# EAGLE design quadripod_2lm_nano (EAGLE 9.0.1)
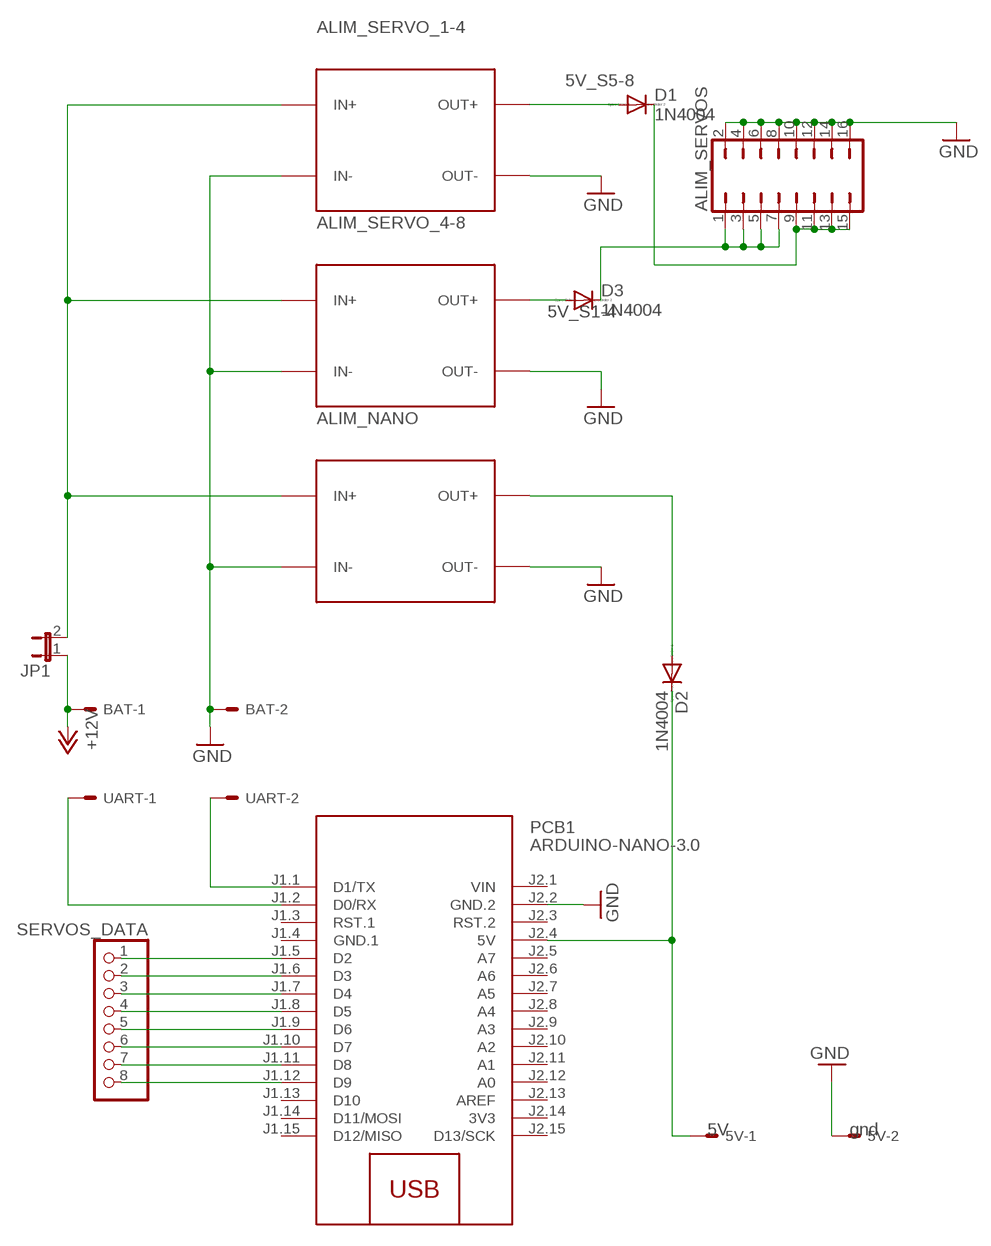
[diagram p0: schematic, sheet 1]

## Parts
5V  332-02  [332-02]
ALIM_NANO  DC-DC-STEP-DOWN-LM2596  [DC-DC-STEP-DOWN-LM2596]
ALIM_SERVO_1-4  DC-DC-STEP-DOWN-LM2596  [DC-DC-STEP-DOWN-LM2596]
ALIM_SERVO_4-8  DC-DC-STEP-DOWN-LM2596  [DC-DC-STEP-DOWN-LM2596]
ALIM_SERVOS  JP8Q  [JP8Q]
BAT  332-02  [332-02]
D1  1N4004  [DO41-10]
D2  1N4004  [DO41-10]
D3  1N4004  [DO41-10]
JP1  JP1E  [JP1]
PCB1  ARDUINO-NANO-3.0  [ARDUINO-NANO-3.0]
SERVOS_DATA  PINHD-1X8  [1X08]
UART  332-02  [332-02]

## Nets
5V_NANO [power]: ALIM_NANO.OUT+ D2.A
5V_S1-4 [power]: ALIM_SERVOS.1 ALIM_SERVOS.3 ALIM_SERVOS.5 ALIM_SERVOS.7 D3.C
5V_S5-8 [power]: ALIM_SERVOS.9 ALIM_SERVOS.11 ALIM_SERVOS.13 ALIM_SERVOS.15 D1.C
+12V [power]: BAT.1 JP1.1
GND [power]: 5V.2 ALIM_NANO.IN- ALIM_NANO.OUT- ALIM_SERVO_1-4.IN- ALIM_SERVO_1-4.OUT- ALIM_SERVO_4-8.IN- ALIM_SERVO_4-8.OUT- ALIM_SERVOS.2 ALIM_SERVOS.4 ALIM_SERVOS.6 ALIM_SERVOS.8 ALIM_SERVOS.10 ALIM_SERVOS.12 ALIM_SERVOS.14 ALIM_SERVOS.16 BAT.2 PCB1.J2.2(GND.2)
N$1: ALIM_SERVO_4-8.OUT+ D3.A
N$2: PCB1.J1.5(D2) SERVOS_DATA.1
N$3 [power]: 5V.1 D2.C PCB1.J2.4(5V)
N$4: ALIM_SERVO_1-4.OUT+ D1.A
N$5: PCB1.J1.6(D3) SERVOS_DATA.2
N$6: PCB1.J1.7(D4) SERVOS_DATA.3
N$7: PCB1.J1.8(D5) SERVOS_DATA.4
N$8: PCB1.J1.9(D6) SERVOS_DATA.5
N$9: PCB1.J1.10(D7) SERVOS_DATA.6
N$10: PCB1.J1.11(D8) SERVOS_DATA.7
N$11: PCB1.J1.12(D9) SERVOS_DATA.8
N$13: PCB1.J1.2(D0/RX) UART.1
N$14: PCB1.J1.1(D1/TX) UART.2
N$15 [power]: ALIM_NANO.IN+ ALIM_SERVO_1-4.IN+ ALIM_SERVO_4-8.IN+ JP1.2
Unconnected: PCB1.J1.3(RST.1) PCB1.J1.13(D10) PCB1.J1.14(D11/MOSI) PCB1.J1.15(D12/MISO) PCB1.J2.3(RST.2) PCB1.J2.5(A7) PCB1.J2.6(A6) PCB1.J2.7(A5) PCB1.J2.8(A4) PCB1.J2.9(A3) PCB1.J2.10(A2) PCB1.J2.11(A1) PCB1.J2.12(A0) PCB1.J2.13(AREF) PCB1.J2.15(D13/SCK)

## Power pins joined to a net without a drawn wire
3V3: PCB1.J2.14(3V3)
GND.1: PCB1.J1.4(GND.1)
VIN: PCB1.J2.1(VIN)

## Library data of the parts
5V = con-garry:332-02: 2 Pin - 2mm Dual Row Source: www.mpe-connector.de / garry_shortform_2012.pdf; V: 5V; VOLT: gnd
ALIM_NANO ALIM_SERVO_1-4 ALIM_SERVO_4-8 = diy-modules:DC-DC-STEP-DOWN-LM2596: DC/DC Step-Down Regulator based on LM2596-ADJ chip LM2596 datasheet available here: http://www.ti.com/lit/ds/symlink/lm2596.pdf Click here to find device on ebay.com <http://www.ebay.com/sch/lm2596+power+regulator>
ALIM_SERVOS = jumper:JP8Q: JUMPER
BAT = con-garry:332-02: 2 Pin - 2mm Dual Row Source: www.mpe-connector.de / garry_shortform_2012.pdf; VOLT: gnd; VOLTAGE: 12V
D1-D3 = diode:1N4004: DIODE general purpose rectifier, 1 A
JP1 = jumper:JP1E: JUMPER
PCB1 = diy-modules:ARDUINO-NANO-3.0: Arduino Nano 3.0 and compatible devices More details available here: https://www.arduino.cc/en/Main/ArduinoBoardNano Click here to find device on ebay.com <http://www.ebay.com/sch/arduino+nano>
SERVOS_DATA = pinhead:PINHD-1X8: PIN HEADER
UART = con-garry:332-02: 2 Pin - 2mm Dual Row Source: www.mpe-connector.de / garry_shortform_2012.pdf

## Net classes
0 default: width 0.254 mm, drill 0.127 mm, clearance 0.254 mm
1 power: width 0.508 mm, drill 0.127 mm, clearance 0.762 mm

## Board
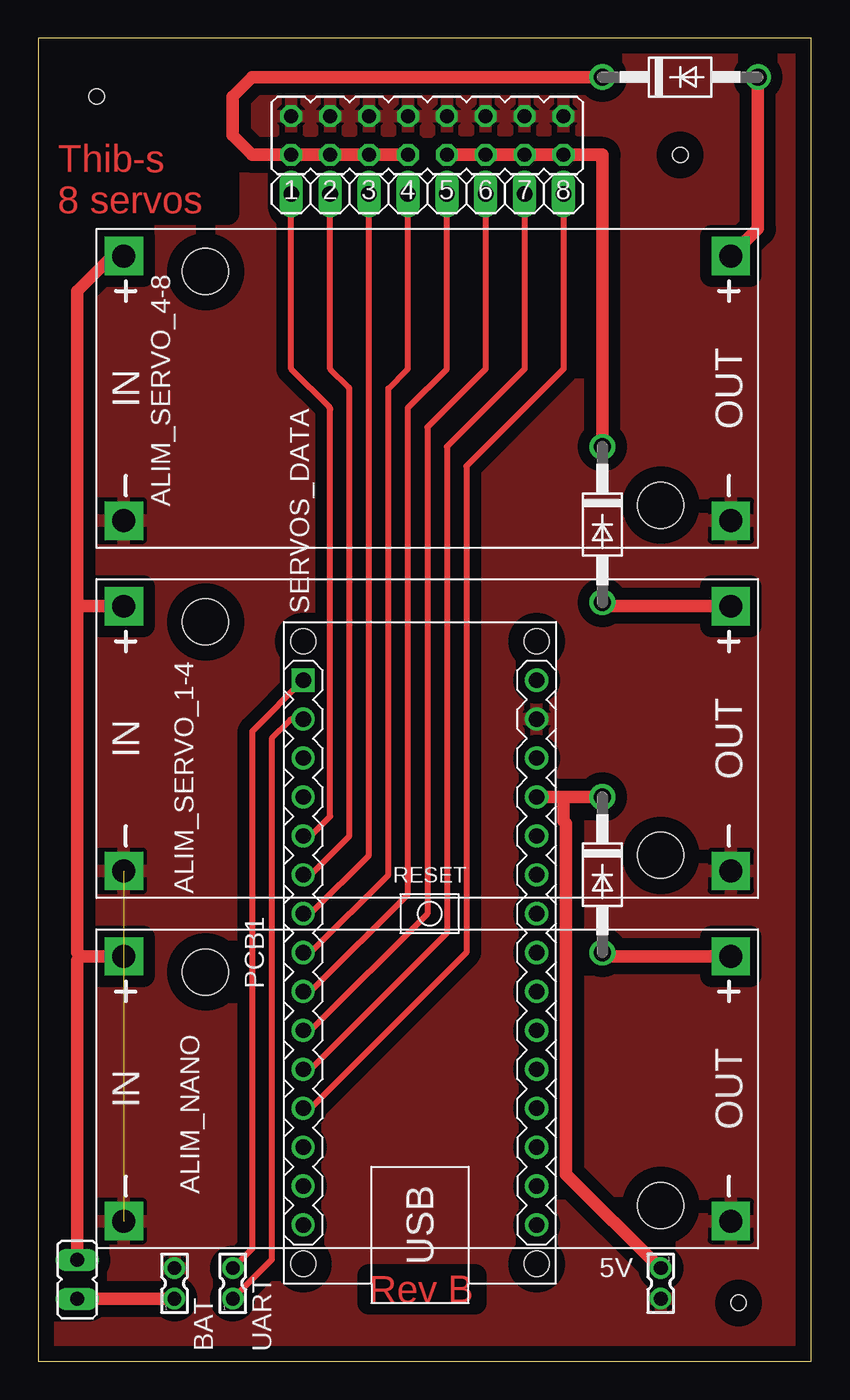
[diagram p1: board, top side]

Size 50.47 x 86.35 mm. Coordinates in mm from the lower left corner, seen from the top.
Outline: 0,0 50.47,0 50.47,86.35 0,86.35 0,0
Copper layers (1*16): Top 0.035mm / dielectric 1.5mm / Bottom 0.035mm
Design rules "default": minimum track width 6mil, minimum drill 0.35mm, track to track 6mil, track to pad 6mil, pad to pad 6mil, via to via 6mil, smd to smd 6mil, copper to edge 40mil, drill to drill 6mil, minimum pad ring 10mil, minimum via ring 8mil, stop-mask expansion 4mil, vias tented up to drill 0mil, thermal gap 10mil
Holes 1 mm at 3.81,82.55 45.72,3.81 41.91,78.74

### Footprints (pad centres in the part's own frame; a part is rotated, then mirrored left to right if it is on the bottom)
332-02 = drill 0.9 pad 1.27: 1 0,-1; 2 0,1
DC-DC-STEP-DOWN-LM2596 = drill 1.5 pad 2.5 square: IN+ -19.812,8.636; IN- -19.812,-8.636; OUT+ 19.812,8.636; OUT- 19.812,-8.636 | hole 3: -14.478,7.62; 15.24,-7.62
JP8Q = drill 0.914 octagon: 1 -8.89,-1.27; 2 -8.89,1.27; 3 -6.35,-1.27; 4 -6.35,1.27; 5 -3.81,-1.27; 6 -3.81,1.27; 7 -1.27,-1.27; 8 -1.27,1.27; 9 1.27,-1.27; 10 1.27,1.27; 11 3.81,-1.27; 12 3.81,1.27; 13 6.35,-1.27; 14 6.35,1.27; 15 8.89,-1.27; 16 8.89,1.27
DO41-10 = drill 1.118: A 5.08,0; C -5.08,0
JP1 = drill 0.914 long: 1 0,-1.27; 2 0,1.27
ARDUINO-NANO-3.0 = drill 1 square: J1.1 17.78,7.62 | drill 1: J1.2 15.24,7.62; J1.3 12.7,7.62; J1.4 10.16,7.62; J1.5 7.62,7.62; J1.6 5.08,7.62; J1.7 2.54,7.62; J1.8 0,7.62; J1.9 -2.54,7.62; J1.10 -5.08,7.62; J1.11 -7.62,7.62; J1.12 -10.16,7.62; J1.13 -12.7,7.62; J1.14 -15.24,7.62; J1.15 -17.78,7.62; J2.1 17.78,-7.62; J2.2 15.24,-7.62; J2.3 12.7,-7.62; J2.4 10.16,-7.62; J2.5 7.62,-7.62; J2.6 5.08,-7.62; J2.7 2.54,-7.62; J2.8 0,-7.62; J2.9 -2.54,-7.62; J2.10 -5.08,-7.62; J2.11 -7.62,-7.62; J2.12 -10.16,-7.62; J2.13 -12.7,-7.62; J2.14 -15.24,-7.62; J2.15 -17.78,-7.62 | hole 1.651: -20.32,7.62; -20.32,-7.62; 20.32,-7.62; 20.32,7.62
1X08 = drill 1.016 long: 1 -8.89,0; 2 -6.35,0; 3 -3.81,0; 4 -1.27,0; 5 1.27,0; 6 3.81,0; 7 6.35,0; 8 8.89,0

### Placement (x,y rotation side)
5V  40.64,5.08 180 top
ALIM_NANO  25.4,17.78 0 top
ALIM_SERVO_1-4  25.4,40.64 0 top
ALIM_SERVO_4-8  25.4,63.5 0 top
ALIM_SERVOS  25.4,80.01 0 top
BAT  8.89,5.08 0 top
D1  36.83,54.61 270 top
D2  36.83,31.75 270 top
D3  41.91,83.82 0 top
JP1  2.54,5.33 0 top
PCB1  24.92,26.67 90 top
SERVOS_DATA  25.4,76.2 0 top
UART  12.7,5.08 0 top

### Tracks (layer width: path | path; a pad name or v marks a point on that pad's centre or on a via)
5V_NANO
  Top 0.813: ALIM_NANO.OUT+ 37.08,26.42 D2.A
5V_S1-4
  Top 0.813: ALIM_SERVOS.7 ALIM_SERVOS.5 ALIM_SERVOS.3 ALIM_SERVOS.1 13.97,78.74 12.7,80.01 12.7,82.55 13.97,83.82 D3.C
5V_S5-8
  Top 0.813: ALIM_SERVOS.9 ALIM_SERVOS.11 ALIM_SERVOS.13 ALIM_SERVOS.15 36.83,78.74 D1.C
+12V
  Top 0.813: JP1.1 8.87,4.06 BAT.1
GND  (1 unrouted)
  pour Top: -1.27,87.63 -1.27,-2.54 53.34,-2.54 53.34,87.63
N$1
  Top 0.813: ALIM_SERVO_4-8.OUT+ 46.99,73.91 D3.A
N$2
  Top 0.406: PCB1.J1.5 17.67,34.29 arc45 17.85,34.36 19.05,35.56 19.05,62.12 arc45 18.98,62.3 16.51,64.77 SERVOS_DATA.1
N$3
  Top 0.813: D2.C 34.29,36.83 | 34.29,36.83 PCB1.J2.4 | 34.29,36.83 34.29,35.26 34.46,35.09 34.46,12.21 40.64,6.03 5V.1
N$4
  Top 0.813: ALIM_SERVO_1-4.OUT+ 37.08,49.28 D1.A
N$5
  Top 0.406: PCB1.J1.6 17.78,31.75 20.32,34.29 20.32,63.39 arc45 20.25,63.57 19.05,64.77 SERVOS_DATA.2
N$6
  Top 0.406: PCB1.J1.7 17.67,29.21 arc45 17.85,29.28 21.59,33.02 SERVOS_DATA.3
N$7
  Top 0.406: PCB1.J1.8 17.67,26.67 arc45 17.85,26.74 22.86,31.75 22.86,63.5 24.06,64.7 arc45 24.13,64.88 SERVOS_DATA.4
N$8
  Top 0.406: PCB1.J1.9 17.67,24.13 arc45 17.85,24.2 24.13,30.48 24.13,62.23 26.67,64.77 SERVOS_DATA.5
N$9
  Top 0.406: PCB1.J1.10 17.67,21.59 arc45 17.85,21.66 25.4,29.21 25.4,60.96 29.21,64.77 SERVOS_DATA.6
N$10
  Top 0.406: PCB1.J1.11 17.67,19.05 arc45 17.85,19.12 26.67,27.94 26.67,59.69 31.75,64.77 SERVOS_DATA.7
N$11
  Top 0.406: PCB1.J1.12 17.67,16.51 arc45 17.85,16.58 27.94,26.67 27.94,58.42 34.29,64.77 SERVOS_DATA.8
N$13
  Top 0.406: PCB1.J1.2 16.62,41.91 arc45 16.44,41.84 15.24,40.64 15.24,6.62 UART.1
N$14
  Top 0.406: PCB1.J1.1 14.04,41.2 arc45 13.97,41.02 13.97,7.35 UART.2
N$15
  Top 0.813: ALIM_SERVO_4-8.IN+ 4.83,72.14 2.54,69.85 2.54,49.53 | 2.54,49.53 2.79,49.28 ALIM_SERVO_1-4.IN+ | 2.54,49.53 2.54,26.67 2.79,26.42 | 2.79,26.42 ALIM_NANO.IN+ | 2.79,26.42 2.54,26.16 JP1.2

### Text on the board
Top: Thib-s / 8 servos | Rev B